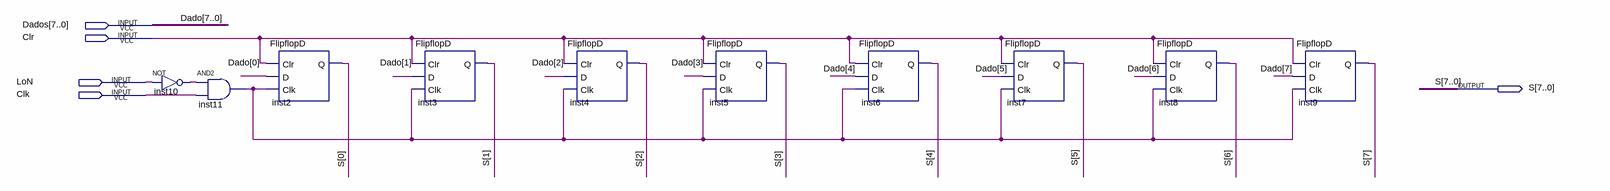
[diagram p0: schematic sheet]
// Quartus schematic registerout.bdf as structural Verilog: 10 symbols, 5 pins
module registerout (
  input  [7:0] Dados,
  input  Clr,
  input  LoN,
  input  Clk,
  output [7:0] S
);

  wire inst10_out, inst11_out;

  not inst10 (inst10_out, LoN);
  and inst11 (inst11_out, inst10_out, Clk);
  FlipflopD inst2 (.Clr(Clr), .D(Dados[0]), .Clk(inst11_out), .Q(S[0]));
  FlipflopD inst3 (.Clr(Clr), .D(Dados[1]), .Clk(inst11_out), .Q(S[1]));
  FlipflopD inst4 (.Clr(Clr), .D(Dados[2]), .Clk(inst11_out), .Q(S[2]));
  FlipflopD inst5 (.Clr(Clr), .D(Dados[3]), .Clk(inst11_out), .Q(S[3]));
  FlipflopD inst6 (.Clr(Clr), .D(Dados[4]), .Clk(inst11_out), .Q(S[4]));
  FlipflopD inst7 (.Clr(Clr), .D(Dados[5]), .Clk(inst11_out), .Q(S[5]));
  FlipflopD inst8 (.Clr(Clr), .D(Dados[6]), .Clk(inst11_out), .Q(S[6]));
  FlipflopD inst9 (.Clr(Clr), .D(Dados[7]), .Clk(inst11_out), .Q(S[7]));

  // Other names for the same wires on the sheet: Dado[7:0] = Dados
endmodule
